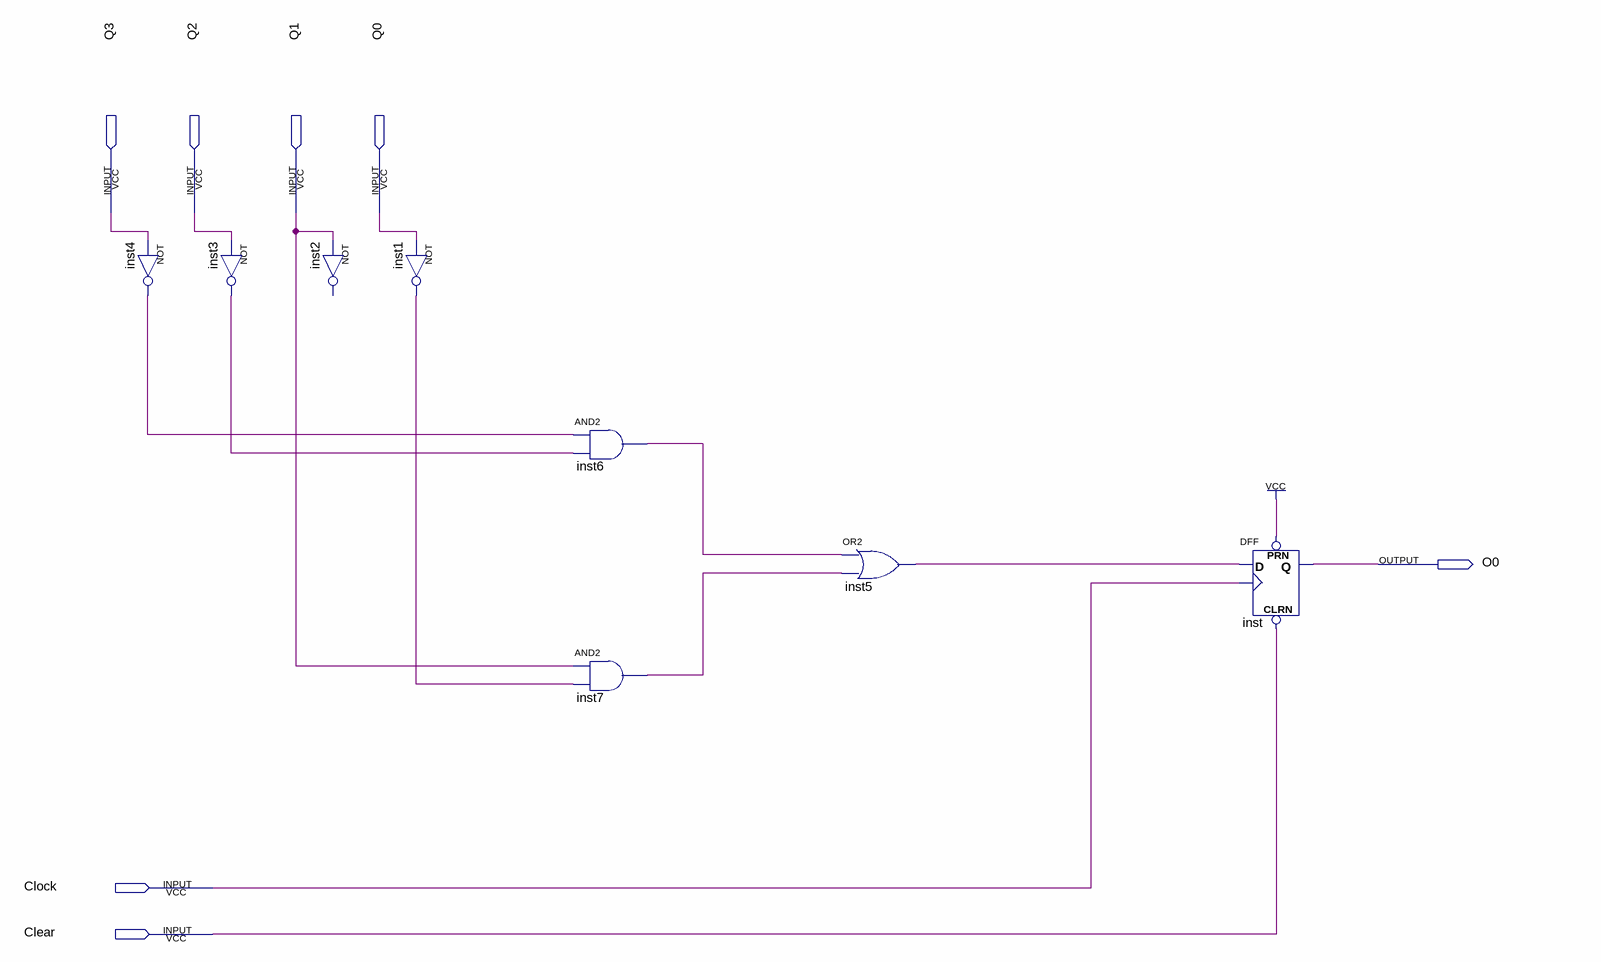
[diagram p0: schematic sheet]
// Quartus schematic D0.bdf as structural Verilog: 8 symbols, 7 pins
module D0 (
  input  Q3,
  input  Q2,
  input  Q1,
  input  Q0,
  input  Clock,
  input  Clear,
  output O0
);

  wire inst1_out, inst3_out, inst4_out, inst5_out, inst6_out, inst7_out;

  not inst4 (inst4_out, Q3);
  not inst3 (inst3_out, Q2);
  // NOT inst2 has open pins: IN=Q1, OUT=open
  not inst1 (inst1_out, Q0);
  and inst6 (inst6_out, inst4_out, inst3_out);
  and inst7 (inst7_out, Q1, inst1_out);
  or inst5 (inst5_out, inst6_out, inst7_out);
  DFF inst (.CLRN(Clear), .CLK(Clock), .D(inst5_out), .PRN(1'b1), .Q(O0));
endmodule
